# EAGLE design EMGPreamp_extRef (EAGLE 6.6.0)
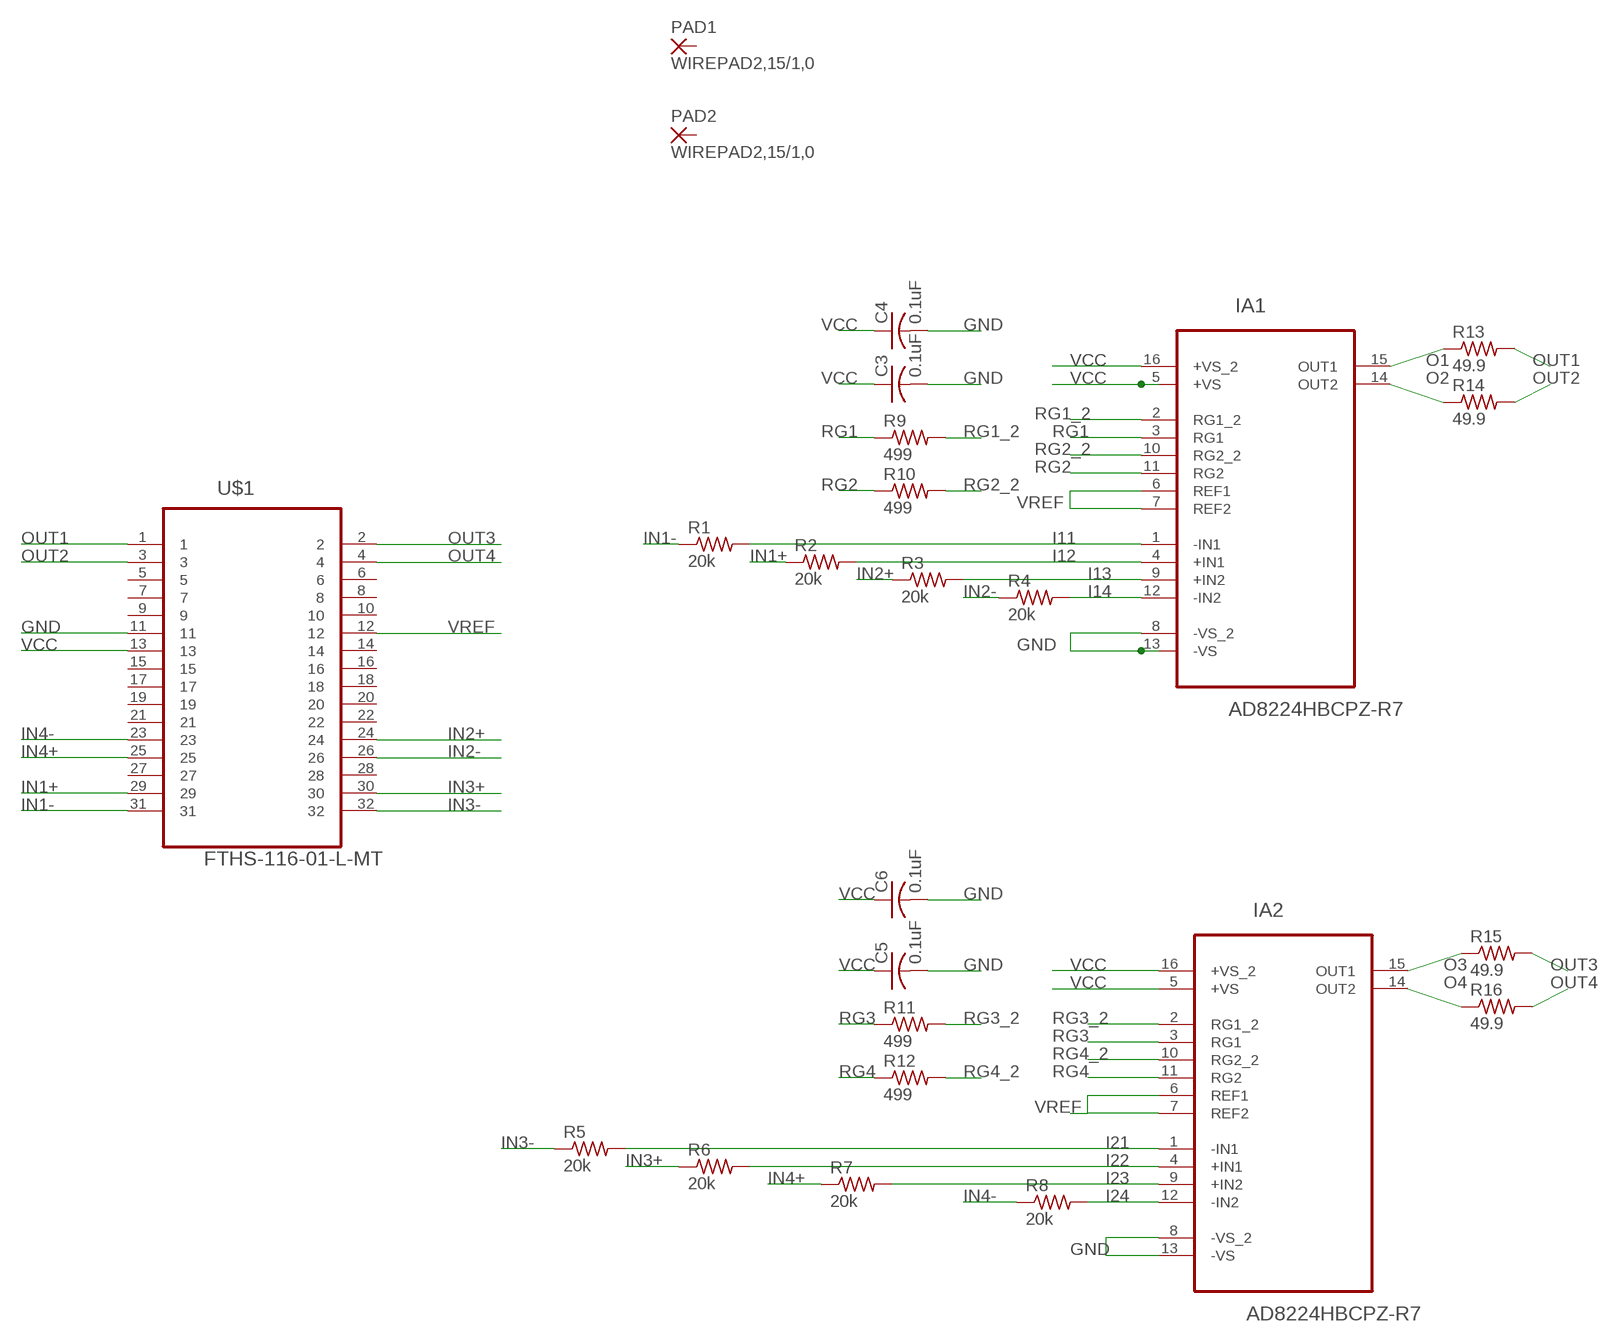
[diagram p0: schematic, sheet 1]

## Parts
C3  0.1uF  C-USC0805  [C0805]
C4  0.1uF  C-USC0805  [C0805]
C5  0.1uF  C-USC0805  [C0805]
C6  0.1uF  C-USC0805  [C0805]
IA1  AD8224HBCPZ-R7  [QFN65P400X400X100-16N]
IA2  AD8224HBCPZ-R7  [QFN65P400X400X100-16N]
PAD1  WIREPAD2,15/1,0  [2,15/1,0]
PAD2  WIREPAD2,15/1,0  [2,15/1,0]
R1  20k  R-US_R0805  [R0805]
R2  20k  R-US_R0805  [R0805]
R3  20k  R-US_R0805  [R0805]
R4  20k  R-US_R0805  [R0805]
R5  20k  R-US_R0805  [R0805]
R6  20k  R-US_R0805  [R0805]
R7  20k  R-US_R0805  [R0805]
R8  20k  R-US_R0805  [R0805]
R9  499  R-US_R0805  [R0805]
R10  499  R-US_R0805  [R0805]
R11  499  R-US_R0805  [R0805]
R12  499  R-US_R0805  [R0805]
R13  49.9  R-US_R0805  [R0805]
R14  49.9  R-US_R0805  [R0805]
R15  49.9  R-US_R0805  [R0805]
R16  49.9  R-US_R0805  [R0805]
U$1  FTHS-116-01-L-MT  [FTSH-116-1-L-MT]

## Nets
GND: C3.2 C4.2 C5.2 C6.2 IA1.8(-VS_2) IA1.13(-VS) IA2.8(-VS_2) IA2.13(-VS) U$1.11
I11: IA1.1(-IN1) R1.2
I12: IA1.4(+IN1) R2.2
I13: IA1.9(+IN2) R3.2
I14: IA1.12(-IN2) R4.2
I21: IA2.1(-IN1) R5.2
I22: IA2.4(+IN1) R6.2
I23: IA2.9(+IN2) R7.2
I24: IA2.12(-IN2) R8.2
IN1+: R2.1 U$1.29
IN1-: R1.1 U$1.31
IN2+: R3.1 U$1.24
IN2-: R4.1 U$1.26
IN3+: R6.1 U$1.30
IN3-: R5.1 U$1.32
IN4+: R7.1 U$1.25
IN4-: R8.1 U$1.23
O1: IA1.15(OUT1) R13.1
O2: IA1.14(OUT2) R14.1
O3: IA2.15(OUT1) R15.1
O4: IA2.14(OUT2) R16.1
OUT1: R13.2 U$1.1
OUT2: R14.2 U$1.3
OUT3: R15.2 U$1.2
OUT4: R16.2 U$1.4
RG1: IA1.3(RG1) R9.1
RG1_2: IA1.2(RG1_2) R9.2
RG2: IA1.11(RG2) R10.1
RG2_2: IA1.10(RG2_2) R10.2
RG3: IA2.3(RG1) R11.1
RG3_2: IA2.2(RG1_2) R11.2
RG4: IA2.11(RG2) R12.1
RG4_2: IA2.10(RG2_2) R12.2
VCC: C3.1 C4.1 C5.1 C6.1 IA1.5(+VS) IA1.16(+VS_2) IA2.5(+VS) IA2.16(+VS_2) U$1.13
VREF: IA1.6(REF1) IA1.7(REF2) IA2.6(REF1) IA2.7(REF2) U$1.12
Unconnected: PAD1.1(P) PAD2.1(P) U$1.5 U$1.6 U$1.7 U$1.8 U$1.9 U$1.10 U$1.14 U$1.15 U$1.16 U$1.17 U$1.18 U$1.19 U$1.20 U$1.21 U$1.22 U$1.27 U$1.28

## Library data of the parts
C3-C6 = rcl:C-US: CAPACITOR, American symbol
IA1 IA2 = Analog Devices_By_element14_Batch1:AD8224HBCPZ-R7: Precision, Dual-Channel, JFET Input,Rail-to-Rail Instrumentation Amplifier; MPN: AD8224HBCPZ-R7; OC_FARNELL: -; OC_NEWARK: 79R2339; PACKAGE: QFN-16; SUPPLIER: Analog Devices
PAD1 PAD2 = wirepad:WIREPAD: Wire PAD connect wire on PCB
R1-R16 = rcl:R-US_: RESISTOR, American symbol
U$1 = tuckerLib:FTHS-116-01-L-MT

## Board
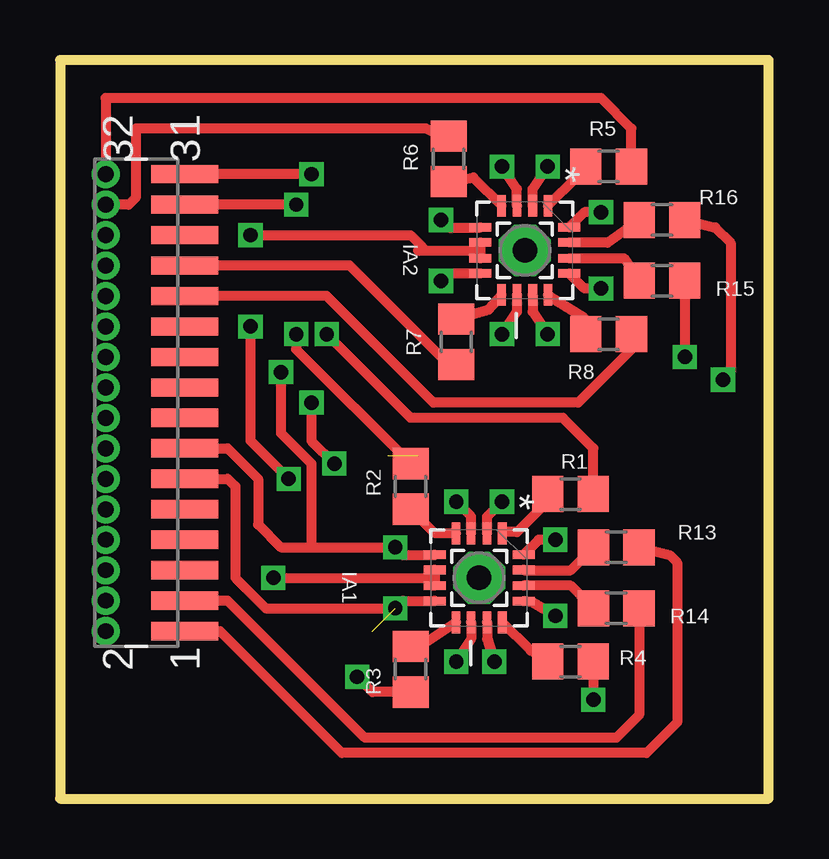
[diagram p1: board, top side]
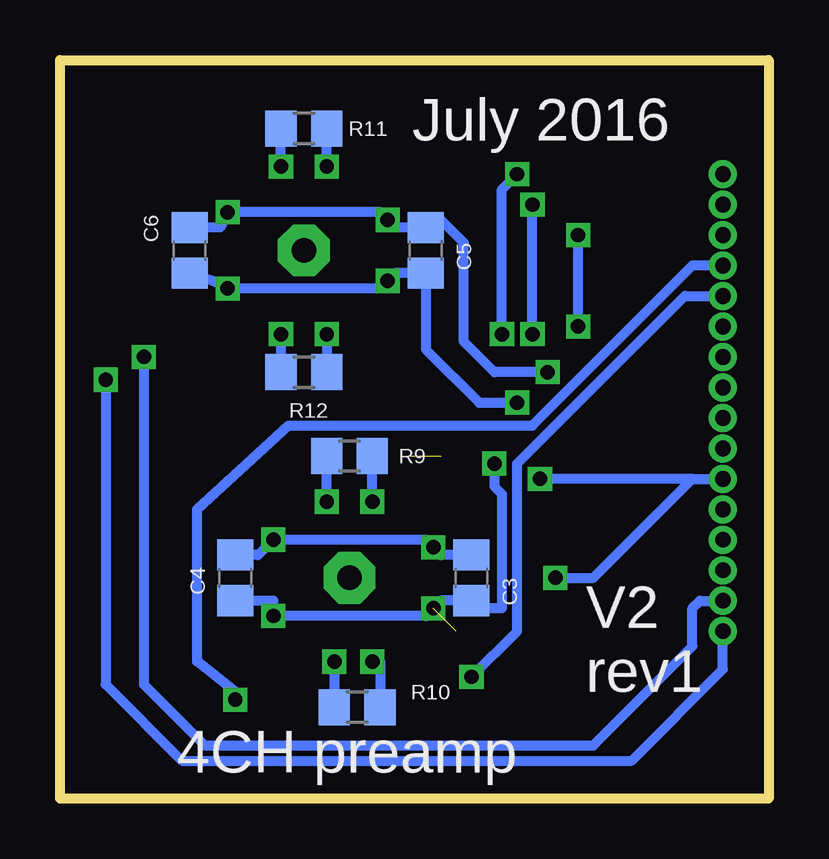
[diagram p2: board, bottom side, seen from below]

Size 29.53 x 30.8 mm. Coordinates in mm from the lower left corner, seen from the top.
Outline: 0,0 29.53,0 29.53,30.8 0,30.8 0,0
Copper layers (1*16): Top 0.035mm / dielectric 1.5mm / Bottom 0.035mm
Design rules "default *": minimum track width 10mil, minimum drill 20mil, track to track 8mil, track to pad 8mil, pad to pad 8mil, via to via 8mil, smd to smd 8mil, copper to edge 40mil, drill to drill 8mil, minimum pad ring 10mil, minimum via ring 8mil, stop-mask expansion 4mil, vias tented up to drill 0mil, thermal gap 10mil

### Footprints (pad centres in the part's own frame; a part is rotated, then mirrored left to right if it is on the bottom)
C0805 = smd 1.3 x 1.5: 1 -0.95,0; 2 0.95,0
QFN65P400X400X100-16N = smd 0.914 x 0.356: 1 -1.854,0.965; 2 -1.854,0.33; 3 -1.854,-0.33; 4 -1.854,-0.965; 9 1.854,-0.965; 10 1.854,-0.33; 11 1.854,0.33; 12 1.854,0.965 | smd 0.356 x 0.914: 5 -0.965,-1.854; 6 -0.33,-1.854; 7 0.33,-1.854; 8 0.965,-1.854; 13 0.965,1.854; 14 0.33,1.854; 15 -0.33,1.854; 16 -0.965,1.854
2,15/1,0 = drill 1.016 pad 2.159 octagon: 1 0,0
R0805 = smd 1.3 x 1.5: 1 -0.95,0; 2 0.95,0
FTSH-116-1-L-MT = smd 0.762 x 2.794: 1 -9.525,-2.032; 3 -8.255,-2.032; 5 -6.985,-2.032; 7 -5.715,-2.032; 9 -4.445,-2.032; 11 -3.175,-2.032; 13 -1.905,-2.032; 15 -0.635,-2.032; 17 0.635,-2.032; 19 1.905,-2.032; 21 3.175,-2.032; 23 4.445,-2.032; 25 5.715,-2.032; 27 6.985,-2.032; 29 8.255,-2.032; 31 9.525,-2.032 | drill 0.66: 2 -9.525,1.27; 4 -8.255,1.27; 6 -6.985,1.27; 8 -5.715,1.27; 10 -4.445,1.27; 12 -3.175,1.27; 14 -1.905,1.27; 16 -0.635,1.27; 18 0.635,1.27; 20 1.905,1.27; 22 3.175,1.27; 24 4.445,1.27; 26 5.715,1.27; 28 6.985,1.27; 30 8.255,1.27; 32 9.525,1.27

### Placement (x,y rotation side)
C3  12.38,9.21 270 bottom
C4  22.23,9.21 270 bottom
C5  14.29,22.86 270 bottom
C6  24.13,22.86 270 bottom
IA1  17.46,9.21 270 top
IA2  19.37,22.86 270 top
PAD1  19.37,22.86 180 top
PAD2  17.46,9.21 180 top
R1  21.27,12.7 180 top
R2  14.61,13.02 270 top
R3  14.61,5.4 90 top
R4  21.27,5.71 180 top
R5  22.86,26.35 180 top
R6  16.19,26.67 270 top
R7  16.51,19.05 90 top
R8  22.86,19.37 180 top
R9  17.46,14.29 180 bottom
R10  17.14,3.81 0 bottom
R11  19.37,27.94 180 bottom
R12  19.37,17.78 0 bottom
R13  23.18,10.48 0 top
R14  23.18,7.94 0 top
R15  25.08,24.13 0 top
R16  25.08,21.59 0 top
U$1  3.18,16.51 90 top

### Tracks (layer width: path | path; a pad name or v marks a point on that pad's centre or on a via)
GND  (via drill 0.6)  (1 unrouted)
  Top 0.406: v15.87,21.59 16.19,21.91 17.5,21.91 IA2.8 | v22.54,21.27 21.84,21.27 IA2.13 | v20.64,7.62 19.69,8.19 IA1.13 | IA1.8 15.6,8.26 14.29,8.26 v13.97,7.94 8.57,7.94 7.3,9.21 7.3,13.02 6.98,13.34 U$1.11 | v10.48,16.51 10.48,14.92 v11.43,13.97
  Bottom 0.406: C3.2 13.65,8.26 v13.97,7.94 14.29,7.62 v20.64,7.62 20.64,8.26 C4.2 | C6.2 23.18,21.59 v22.54,21.27 16.19,21.27 v15.87,21.59 15.55,21.91 C5.2 14.29,18.73 12.07,16.51 v10.48,16.51 | 12.07,7.94 C3.2 | v11.43,13.97 11.43,13.02 11.11,12.7 11.11,7.94 12.06,7.94 C3.2
I11
  Top 0.406: R1.2 19.99,12.05 19.05,11.11 18.48,11.11 IA1.1
I12
  Top 0.406: IA1.4 15.62,11.06 R2.2
I13
  Top 0.406: R3.2 14.29,6.03 14.54,6.03 IA1.9
I14
  Top 0.406: R4.2 19.61,6.17 IA1.12
I21
  Top 0.406: R5.2 21.51,25.89 IA2.1
I22
  Top 0.406: R6.2 17.22,25.89 IA2.4
I23
  Top 0.406: IA2.9 17.85,20.37 R7.2
I24
  Top 0.406: IA2.12 21.84,20.05 R8.2
IN1+  (via drill 0.6)  (1 unrouted)
  Top 0.406: 14.92,14.29 14.92,13.99 R2.1 9.84,18.73 v9.84,19.37 | v9.84,24.76 U$1.29
  Bottom 0.406: v9.84,19.37 v9.84,24.76
IN1-  (via drill 0.6)
  Top 0.406: R1.1 22.22,14.61 20.96,15.87 14.6,15.87 v11.11,19.37 | v10.48,26.03 U$1.31
  Bottom 0.406: v11.11,19.37 11.11,25.4 v10.48,26.03
IN2+  (via drill 0.6)
  Top 0.406: R3.1 13.01,4.45 v12.38,5.08
  Bottom 0.406: v12.38,5.08 10.48,6.98 10.48,13.97 3.49,20.96 U$1.24
IN2-  (via drill 0.6)
  Top 0.406: R4.1 v22.22,4.13 v22.23,4.13
  Bottom 0.406: v22.23,4.13 22.23,4.45 23.81,5.72 23.81,12.07 20,15.56 9.84,15.56 3.18,22.23 U$1.26
IN3+
  Top 0.406: R6.1 15.88,27.62 15.24,27.94 3.18,27.94 3.18,25.08 2.86,24.76 U$1.30
IN3-
  Top 0.406: R5.1 23.81,27.94 22.54,29.21 1.91,29.21 U$1.32
IN4+
  Top 0.406: R7.1 16.19,18.1 12.07,22.23 U$1.25
IN4-
  Top 0.406: R8.1 23.81,18.73 21.59,16.51 15.56,16.51 11.11,20.96 U$1.23
O1
  Top 0.406: IA1.15 19.33,9.52 21.28,9.52 R13.1
O2
  Top 0.406: R14.1 22.08,8.08 21.27,8.89 19.33,8.89 IA1.14
O3
  Top 0.406: R15.1 22.82,23.18 IA2.15
O4
  Top 0.406: IA2.14 23.51,22.53 R16.1
OUT1
  Top 0.406: R13.2 25.4,10.16 25.72,9.84 25.72,3.18 24.45,1.91 11.75,1.91 6.67,6.98 U$1.1
OUT2
  Top 0.406: R14.2 24.13,3.49 23.18,2.54 12.7,2.54 6.98,8.26 U$1.3
OUT3  (via drill 0.6)
  Top 0.406: R15.2 27.3,23.81 27.94,23.18 27.94,17.78 v27.62,17.46
  Bottom 0.406: v27.62,17.46 27.62,4.76 24.45,1.59 5.72,1.59 1.91,5.4 U$1.2
OUT4  (via drill 0.6)
  Top 0.406: R16.2 v26.03,18.41
  Bottom 0.406: v26.03,18.41 26.03,4.76 23.5,2.22 7.3,2.22 3.18,6.35 3.18,7.94 2.86,8.26 U$1.4
RG1  (via drill 0.6)
  Top 0.406: IA1.3 17.13,11.76 v16.51,12.38
  Bottom 0.406: v16.51,12.38 R9.1
RG1_2  (via drill 0.6)
  Top 0.406: IA1.2 17.79,11.76 v18.41,12.38
  Bottom 0.406: v18.41,12.38 R9.2
RG2  (via drill 0.6)
  Top 0.406: IA1.11 17.79,6.65 v18.1,5.72
  Bottom 0.406: v18.1,5.72 R10.1
RG2_2  (via drill 0.6)
  Top 0.406: IA1.10 17.13,6.65 v16.51,5.72
  Bottom 0.406: v16.51,5.72 16.19,5.72 R10.2
RG3  (via drill 0.6)
  Top 0.406: IA2.3 19.04,25.41 v18.41,26.35
  Bottom 0.406: v18.41,26.35 R11.1
RG3_2  (via drill 0.6)
  Top 0.406: IA2.2 19.7,25.41 v20.32,26.35
  Bottom 0.406: v20.32,26.35 R11.2
RG4  (via drill 0.6)
  Top 0.406: IA2.11 19.7,20.31 v20.32,19.37
  Bottom 0.406: v20.32,19.37 R12.1
RG4_2  (via drill 0.6)
  Top 0.406: IA2.10 19.04,20.31 v18.41,19.37
  Bottom 0.406: v18.41,19.37 R12.2
VCC  (via drill 0.6)
  Top 0.406: v15.87,24.13 16.19,23.81 17.5,23.81 IA2.5 | v22.54,24.45 21.84,24.45 IA2.16 | v20.64,10.79 19.94,10.79 IA1.16 | IA1.5 15.6,10.16 14.29,10.16 v13.97,10.48 10.48,10.48 | U$1.13 6.98,14.6 8.26,13.34 8.26,11.43 9.21,10.48 10.48,10.48 | v9.21,17.78 9.21,15.24 10.48,13.97 10.48,10.48
  Bottom 0.406: C3.1 13.65,10.16 v13.97,10.48 14.29,10.79 v20.64,10.79 21.27,10.16 C4.1 | C6.1 22.86,23.81 v22.54,24.45 16.19,24.45 v15.87,24.13 15.55,23.81 C5.1 13.97,24.13 13.65,24.13 12.7,23.18 12.7,19.05 11.43,17.78 v9.21,17.78
VREF  (via drill 0.6)
  Top 0.406: IA1.6 IA1.7 | IA1.7 15.54,8.88 | 17.5,23.18 IA2.6 IA2.7 17.5,22.86 15.24,22.86 | 14.92,22.86 15.24,22.86 | 15.24,22.86 14.92,23.18 14.6,23.5 v7.94,23.5 | v8.89,9.21 15.28,9.21 IA1.7 | v9.52,13.34 7.94,14.92 v7.94,19.69
  Bottom 0.406: v8.89,9.21 7.3,9.21 3.18,13.34 | 3.18,13.34 U$1.12 | 3.18,13.34 v9.52,13.34 | v7.94,19.69 v7.94,23.5

### Text on the board
bNames: July 2016 | V2 / rev1 | 4CH preamp